# EasyEDA schematic ESP32 MusicBox using Modules_2021-03-20.json
TITLE: Sheet_1; REV: 1.0; Date: 2021-03-20; Sheet: 1/1; Drawn By: Xylen.C4; Company: Your Company
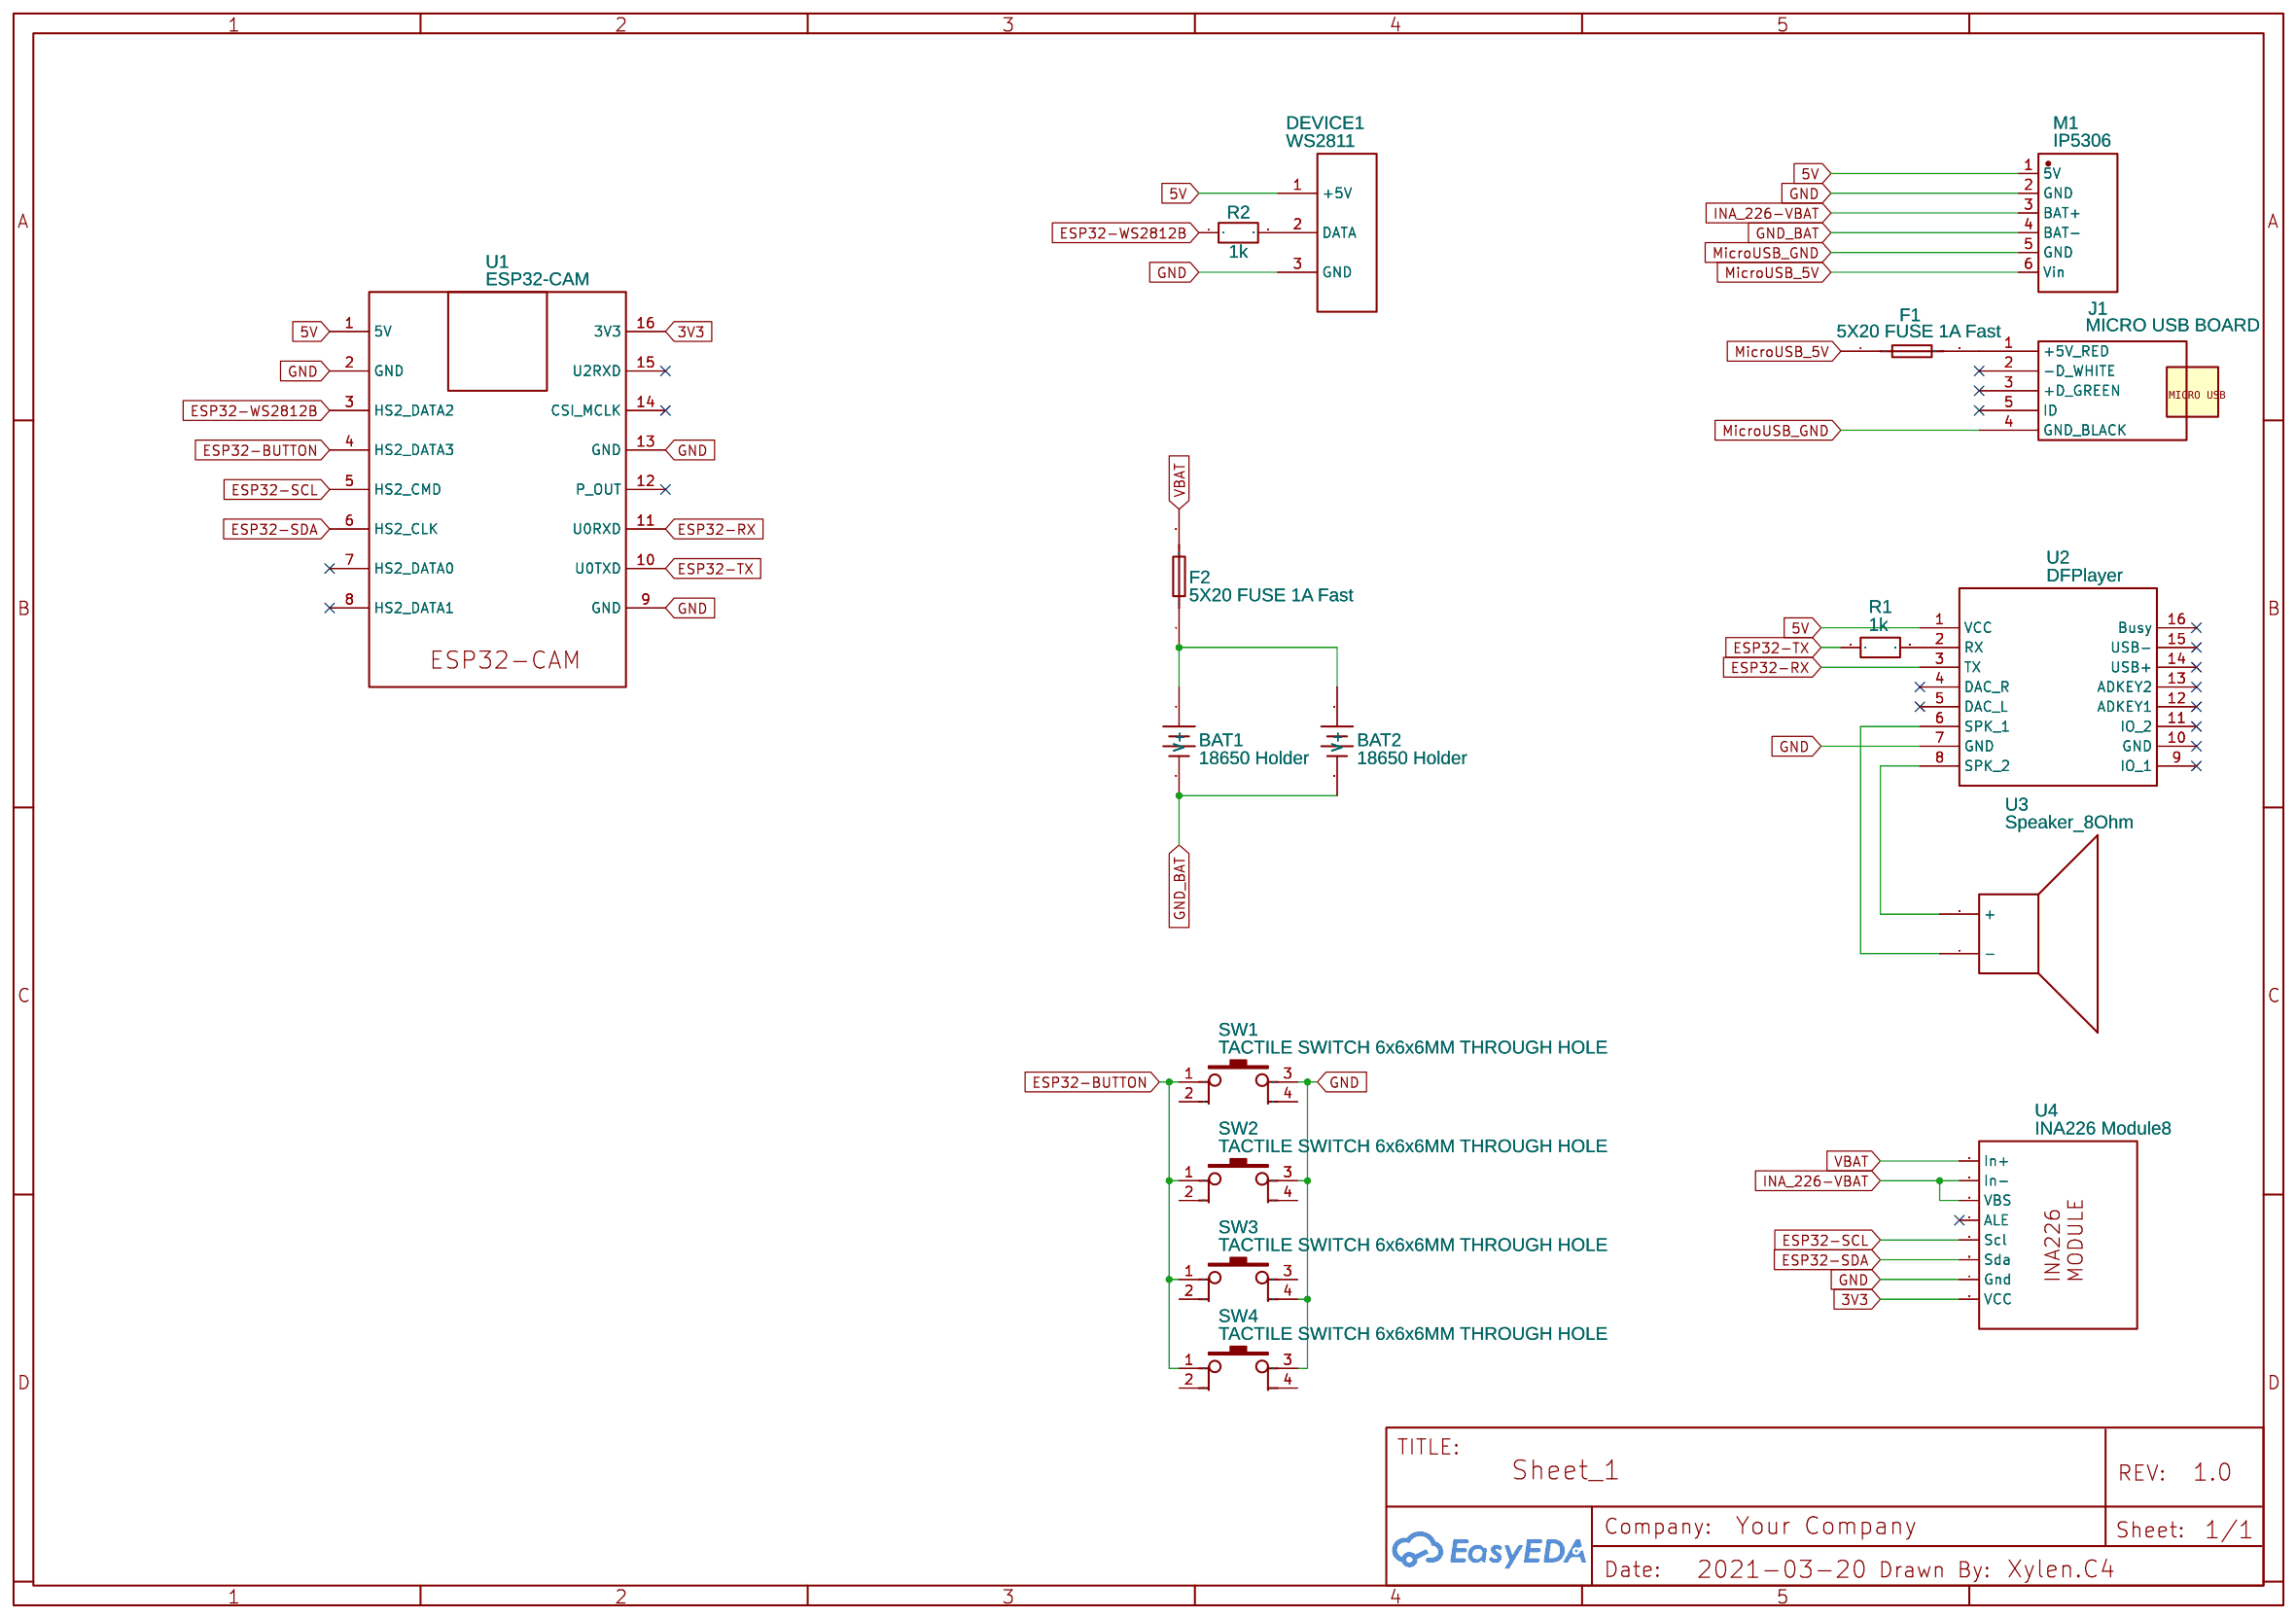
[diagram p0: schematic sheet]

## Parts
BAT1  18650 Holder  [18650 HOLDER]
BAT2  18650 Holder  [18650 HOLDER]
DEVICE1  WS2811
F1  5X20 FUSE 1A Fast  [FUSE-T5X20]
F2  5X20 FUSE 1A Fast  [FUSE-T5X20]
J1  MICRO USB BOARD
M1  IP5306  [IP5306MODULE]
R1  1k  [R_AXIAL-0.5]
R2  1k  [R_AXIAL-0.5]
SW1  TACTILE SWITCH 6x6x6MM THROUGH HOLE  [SW_4PIN_6X6X6_THROUGHHOLE]
SW2  TACTILE SWITCH 6x6x6MM THROUGH HOLE  [SW_4PIN_6X6X6_THROUGHHOLE]
SW3  TACTILE SWITCH 6x6x6MM THROUGH HOLE  [SW_4PIN_6X6X6_THROUGHHOLE]
SW4  TACTILE SWITCH 6x6x6MM THROUGH HOLE  [SW_4PIN_6X6X6_THROUGHHOLE]
U1  ESP32-CAM
U2  DFPlayer  [DFPLAYER_MINI]
U3  Speaker_8Ohm
U4  INA226 Module8  [INA226_MODULE8]

## Library data of the parts
BAT1 BAT2 = 18650 Holder: Manufacturer: Computercable4u; Supplier: Aliexpress; link: https://aliexpress.com/item/32874365172.html; Contributor: nivie
DEVICE1 = WS2811: Manufacturer Part: WS2811 STRING; Contributor: pfountain
F1 F2 = 5X20 FUSE: Supplier: LCSC; Manufacturer Part: 5x20 BLX-Atype Fuse holder XC-7; Manufacturer: XCFuse; image: //image.lceda.cn/szlcsc/C3131.jpg; Supplier Part: C3131
J1 = MICRO USB BOARD: Contributor: Antany
M1 = IP5306: Manufacturer: LantianRC; Manufacturer Part: IP5306 Module; Supplier: LantianRC; Supplier Part: IP5306Mod; Contributor: Alexander Sitnikov
R1 R2 = R_AXIAL-0.5_EU: Contributor: LCEDA_Lib
SW1-SW4 = TACTILE SWITCH 6x6x6MM THROUGH HOLE: Supplier Part: C23873; Supplier: LCSC; Manufacturer: ReliaPro; Manufacturer Part: SMD Tactile Switch6*6*6mm; image: http://image.lceda.cn/szlcsc/C23873.jpg
U1 = ESP32-CAM: Supplier: banggood; Supplier Part: 1394679; Contributor: bernd gruber
U2 = DFPlayer: Contributor: jmmb18797
U3 = Speaker_8Ohm: Manufacturer Part: Speaker; Contributor: EasyDan
U4 = INA226 Module8: Manufacturer Part: INA226; Supplier Part: INA226 MODULE; Supplier: AdaFruit; link: https://www.adafruit.com/product/904; Contributor: Mage34

## Nets
3V3: U1.16(3V3) U4.8(VCC)
5V: DEVICE1.1(+5V) M1.1(5V) U1.1(5V) U2.1(VCC)
GND: DEVICE1.3(GND) M1.2(GND) SW1.3 SW2.3 SW3.4 SW4.3 U1.2(GND) U1.9(GND) U1.13(GND) U2.7(GND) U4.7(Gnd)
GND_BAT: BAT1.2(V-) BAT2.2(V-) M1.4(BAT-)
VBAT: F2.2 U4.1(In+)
ESP32-BUTTON: SW1.1 SW2.1 SW3.1 SW4.1 U1.4(HS2_DATA3)
ESP32-RX: U1.11(U0RXD) U2.3(TX)
ESP32-SCL: U1.5(HS2_CMD) U4.5(Scl)
ESP32-SDA: U1.6(HS2_CLK) U4.6(Sda)
ESP32-TX: R1.1 U1.10(U0TXD)
ESP32-WS2812B: R2.1 U1.3(HS2_DATA2)
INA_226-VBAT: M1.3(BAT+) U4.2(In-) U4.3(VBS)
MicroUSB_5V: F1.1 M1.6(Vin)
MicroUSB_GND: J1.4(GND_BLACK) M1.5(GND)
Net-(BAT1-1): BAT1.1(V+) BAT2.1(V+) F2.1
Net-(DEVICE1-2): DEVICE1.2(DATA) R2.2
Net-(F1-2): F1.2 J1.1(+5V_RED)
Net-(R1-2): R1.2 U2.2(RX)
Net-(U2-6): U2.6(SPK 1) U3.1(-)
Net-(U2-8): U2.8(SPK 2) U3.2(+)

Not connected (* = marked no-connect by the designer): J1 2(-D_WHITE)* 3(+D_GREEN)* 5(ID)*; SW1 2 4; SW2 2 4; SW3 2 3; SW4 2 4; U1 7(HS2_DATA0)* 8(HS2_DATA1)* 12(P_OUT)* 14(CSI_MCLK)* 15(U2RXD)*; U2 4(DAC_R)* 5(DAC_L)* 9(IO 1)* 10(GND)* 11(IO 2)* 12(ADKEY1)* 13(ADKEY2)* 14(USB+)* 15(USB-)* 16(Busy)*; U4 4(ALE)*
